# EAGLE design 3PDT Buffer Board (EAGLE 9.1.0)
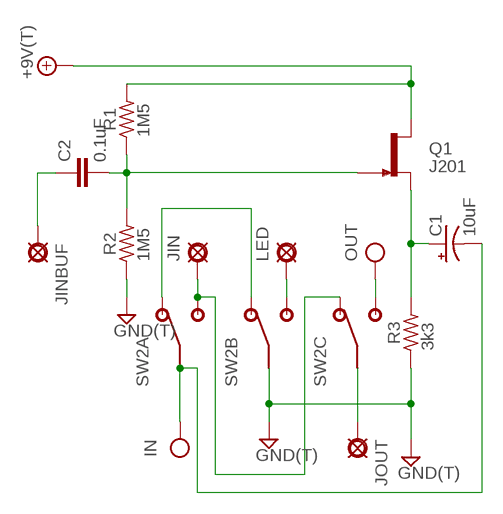
[diagram p0: schematic, sheet 1]

## Parts
+9V  +9V(T)  [SQUARE]
C1  10uF  0501  [050_020_1]
C2  0.1uF  080X0502  [080X050]
G  GND(T)  [SQUARE]
IN  IN(T)  [SQUARE]
JIG  GND(T)  [SQUARE]
JIN  PAD  [SQUARE]
JINBUF  PAD  [SQUARE]
JOG  GND(T)  [SQUARE]
JOUT  PAD  [SQUARE]
LED  PAD  [SQUARE]
OUT  OUT(T)  [SQUARE]
Q1  J201  [TO92-]
R1  1M5  6MM.3  [R0207/3]
R2  1M5  6MM.3  [R0207/3]
R3  3k3  6MM.3  [R0207/3]
SW2  3PDT  [3PDT]

## Nets
+9V: +9V.1(+9V) Q1.3(D) R1.2
GND: G.1(GND) JIG.1(GND) JOG.1(GND) R2.1 R3.1 SW2.B2
IN: C1.- IN.1(IN) SW2.A2
N$1: LED.1(PAD) SW2.B3
N$2: JOUT.1(PAD) SW2.C2
N$3: SW2.A1 SW2.B1
N$4: JIN.1(PAD) SW2.A3 SW2.C1
N$5: C2.2 Q1.1(G) R1.1 R2.2
N$6: C2.1 JINBUF.1(PAD)
N$7: C1.+ Q1.2(S) R3.2
OUT: OUT.1(OUT) SW2.C3

## Library data of the parts
+9V = mb_supply:+9V(T): +9V Voltage Supply use this to hook up +9v throughout a schematic instead of running wire automatically labels the net "+9v" adds a hookup pad to the circuit board
C1 = mb_caps-electro:050: 0.22 - 100uF Xicon values at Mouser.com: 10V: 10 - 100uF; 16V: 2.2 - 47uF; 25V: 0.47 - 47uF; 50V: 0.22 - 22uF
C2 = mb_caps-chicklet:080X050: 0.1uF Panasonic ECQ-B 8mm x 5mm
G JIG JOG = mb_supply:GND(T): Ground use this to hook up ground (GND) throughout a schematic instead of running wire automatically labels the net "GND" adds a hookup pad to the circuit board (you can use several)
IN = mb_supply:IN(T): Input obsolete: use Pad instead and label net shematic input label with circuit board terminal/pad generally used only once on a schematic (because this device labels the net "IN" in the same way as a voltage supply or ground net)
JIN JINBUF JOUT LED = mb_supply:PAD: PAD use this package for pads with any purpose, including input, output, send or return various pad shapes: round, square, octogonal, long, and long offset
OUT = mb_supply:OUT(T): Output obsolete: use Pad instead and label net output label with circuit board terminal/pad usually appears only once on a schematic
Q1 = mb_trans:J201: N-channel JFET
R1-R3 = mb_resistors:6MM: 6mm Resistors Leads spaced 1-6 holes apart for 0.1" perfboard. Suitable for 1/4 watt resistors.
SW2 = mb_switches:3PDT

## Board
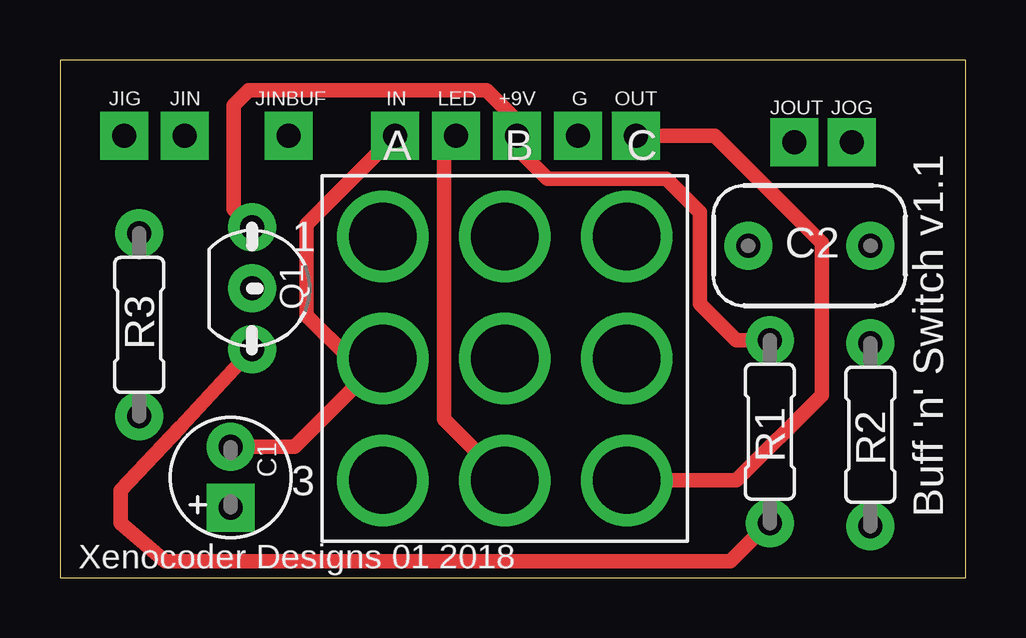
[diagram p1: board, top side]
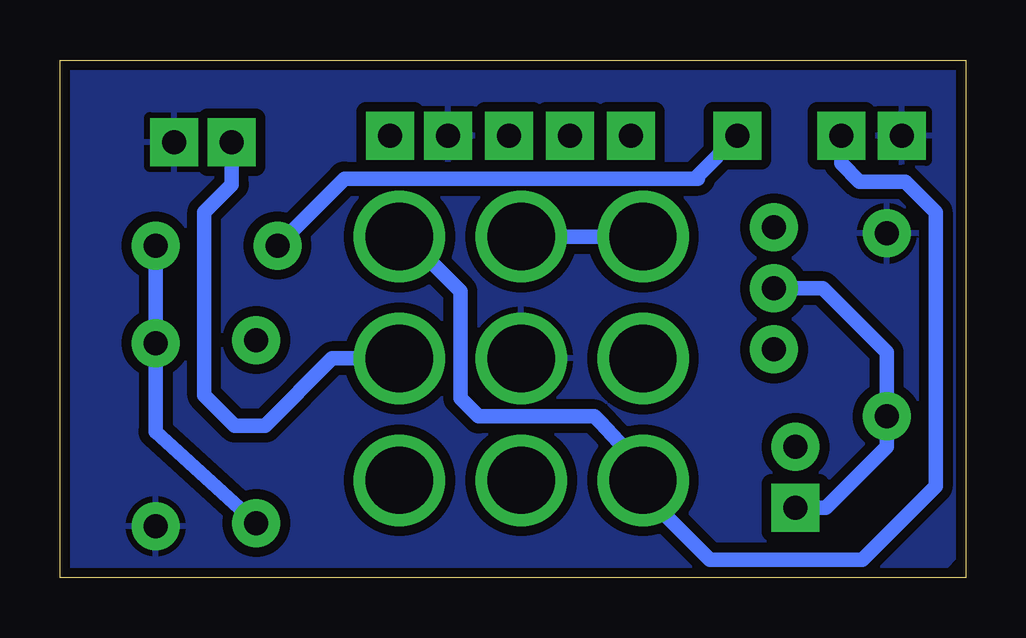
[diagram p2: board, bottom side, seen from below]

Size 37.77 x 21.58 mm. Coordinates in mm from the lower left corner, seen from the top.
Outline: 0,0 37.77,0 37.77,21.58 0,21.58 0,0
Copper layers (1*16): Top 0.035559375mm / dielectric 1.6mm / Bottom 0.035559375mm
Design rules "oshpark-2layer": minimum track width 6mil, minimum drill 10mil, track to track 6mil, track to pad 6mil, pad to pad 6mil, via to via 6mil, smd to smd 6mil, copper to edge 15mil, drill to drill 6mil, minimum pad ring 5mil, minimum via ring 5mil, stop-mask expansion 2.5mil, vias tented up to drill 0mil, thermal gap 10mil

### Footprints (pad centres in the part's own frame; a part is rotated, then mirrored left to right if it is on the bottom)
SQUARE = drill 1 pad 2 square: 1 0,0
050_020_1 = drill 1 pad 2 square: + -1.27,0 | drill 1 pad 2: - 1.27,0
080X050 = drill 1 pad 2: 1 -2.54,0; 2 2.54,0
TO92- = drill 1 pad 2: 1 2.54,0; 2 0,0; 3 -2.54,0
R0207/3 = drill 1 pad 2: 1 -3.81,0; 2 3.81,0
3PDT = drill 2.8 pad 2: A1 -5.08,5.08; A2 -5.08,0; A3 -5.08,-5.08; B1 0,5.08; B2 0,0; B3 0,-5.08; C1 5.08,5.08; C2 5.08,0; C3 5.08,-5.08

### Placement (x,y rotation side)
+9V  19.05,18.41 0 top
C1  7.11,4.19 90 top
C2  31.24,13.84 0 top
G  21.59,18.41 0 top
IN  13.97,18.41 0 top
JIG  2.67,18.41 0 top
JIN  5.21,18.41 0 top
JINBUF  9.53,18.41 0 top
JOG  33.02,18.16 0 top
JOUT  30.61,18.16 0 top
LED  16.51,18.41 0 top
OUT  24,18.41 0 top
Q1  8,12.06 270 top
R1  29.59,6.1 90 top
R2  33.78,5.97 90 top
R3  3.3,10.54 270 top
SW2  18.54,9.14 0 top

### Tracks (layer width: path | path; a pad name or v marks a point on that pad's centre or on a via)
+9V
  Top 0.61: R1.2 28.19,9.91 26.67,11.43 26.67,15.24 25.27,16.64 20.32,16.64 19.05,17.91 +9V.1 19.05,19.05 17.78,20.32 7.87,20.32 7.24,19.68 7.24,15.37 Q1.3
GND
  pour Bottom (isolate 0.406): 0,21.59 0,1.27 1.27,0 38.1,0 38.1,21.59
IN
  Top 0.61: C1.- 9.78,5.46 SW2.A2 12.06,9.14 10.29,10.92 10.29,14.73 IN.1
N$1
  Top 0.61: SW2.B3 16,6.6 16,17.91 LED.1
N$2
  Bottom 0.61: SW2.C2 26.42,9.14 29.21,6.35 30.48,6.35 31.75,7.62 31.75,15.24 30.61,16.38 JOUT.1
N$3
  Bottom 0.61: SW2.B1 SW2.A1
N$4
  Bottom 0.61: SW2.C1 23.37,14.22 21.08,11.94 21.08,7.49 20.32,6.73 15.49,6.73 15.24,6.48 13.46,4.57 SW2.A3 13.46,3.56 10.67,0.76 4.32,0.76 1.27,3.81 1.27,15.24 2.54,16.51 4.45,16.51 5.21,17.27 JIN.1
N$5
  Top 0.61: Q1.1 5.01,6.28 4.63,5.87 2.54,3.65 2.54,2.29 4.39,0.69 27.94,0.69 29.54,2.29 R1.1
  Bottom 0.61: C2.2 R2.2 33.78,6.1 R1.1
N$6
  Bottom 0.61: C2.1 25.91,16.64 11.18,16.64 11.18,16.76 JINBUF.1
N$7
  Bottom 0.61: Q1.2 5.97,12.06 3.3,9.4 R3.2 3.3,5.46 5.84,2.92 C1.+
OUT
  Top 0.61: SW2.C3 28.19,4.06 31.75,7.62 31.75,13.97 27.3,18.41 OUT.1

### Text on the board
tNames: Buff 'n' Switch v1.1 | Xenocoder Designs 01 2018